# Altium schematic sheet MotorBoardHighRes.SchDoc
size A
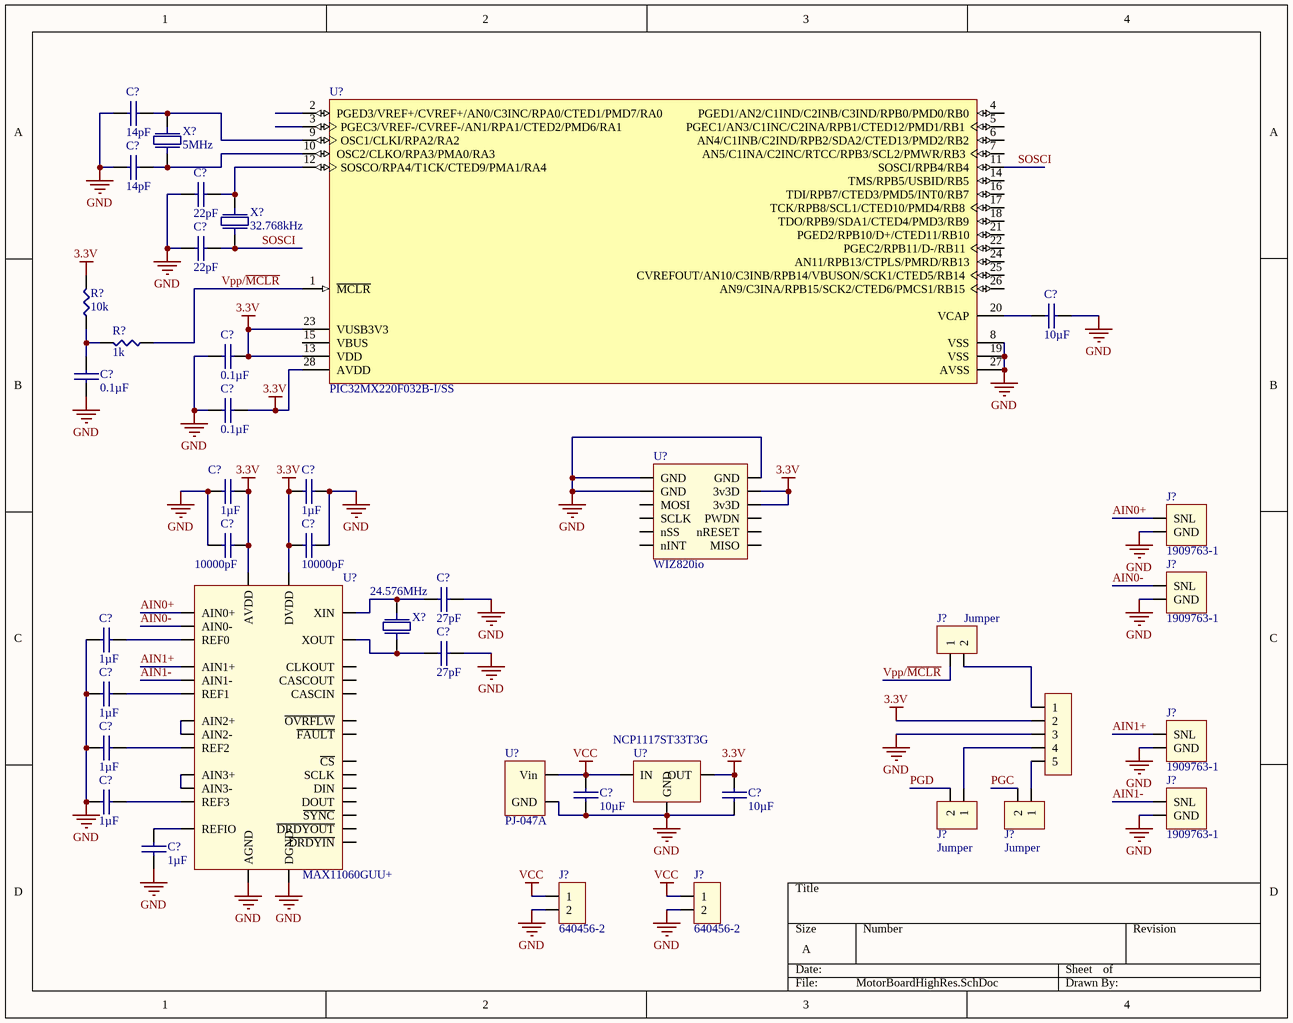
[diagram p0: MotorBoardHighRes.SchDoc]

## Parts
(Parts that share a designator on the sheet are numbered #1, #2 ... from top to bottom, then left to right.)
C?#1  14pF  [C0805]
C?#2  14pF  [C0805]
C?#3  22pF  [C1210]
C?#4  22pF  [C1210]
C?#5  10µF  [C1812]
C?#6  0.1µF  [C1812]
C?#7  0.1µF  [C1812]
C?#8  0.1µF  [C1812]
C?#9  1µF  [C1812]
C?#10  1µF  [C1812]
C?#11  10000pF  [C1812]
C?#12  10000pF  [C1812]
C?#13  27pF  [C1812]
C?#14  1µF  [C1812]
C?#15  27pF  [C1812]
C?#16  1µF  [C1812]
C?#17  1µF  [C1812]
C?#18  10µF  [C1812]
C?#19  10µF  [C1812]
C?#20  1µF  [C1812]
C?#21  1µF  [C1812]
J?#1  1909763-1  [A118077CT-ND]
J?#2  1909763-1  [A118077CT-ND]
J?#3  Jumper  [A1921-ND]
J?#4  1909763-1  [A118077CT-ND]
J?#5  Jumper  [A1921-ND]
J?#6  Jumper  [A1921-ND]
J?#7  1909763-1  [A118077CT-ND]
J?#8  640456-2  [A1921-ND]
J?#9  640456-2  [A1921-ND]
R?#1  10k  [R2010]
R?#2  1k  [R2010]
U?#1  PIC32MX220F032B-I/SS  [MCHP-SSOP-SS28_N]
U?#2  WIZ820io  [WIZ5200]
U?#3  MAX11060GUU+  [MAX11060GUU+-ND]
U?#4  ProgrammingHeader  [ProgrammingHeader]  (value not drawn)
U?#5  PJ-047A  [PJ-047A]
U?#6  NCP1117ST33T3G  [NCP1117ST33T3GOSCT-ND]
X?#1  5MHz  [NX8045GB-5MHZ-STD-CSF-3]
X?#2  32.768kHz  [MC-306 32.7680K-A0:ROHS]
X?#3  24.576MHz  [370-1160-1-ND/535-10195-1-ND]

## Nets
3.3V: C?#6.2 C?#8.2 C?#9.1 C?#10.1 C?#11.2 C?#12.1 C?#19.1 R?#1.2 U?#1.13(VDD) U?#1.23(VUSB3V3) U?#1.28(AVDD) U?#2.10(3v3D) U?#2.11(3v3D) U?#3.12,27(DVDD) U?#3.30(AVDD) U?#4.2 U?#6.2(OUT)
GND: C?#1.1 C?#2.1 C?#3.1 C?#4.1 C?#5.2 C?#6.1 C?#7.2 C?#8.1 C?#9.2 C?#10.2 C?#11.1 C?#12.2 C?#13.2 C?#14.1 C?#15.2 C?#16.1 C?#17.1 C?#18.2 C?#19.2 C?#20.1 C?#21.1 J?#1.1(GND) J?#2.1(GND) J?#4.1(GND) J?#7.1(GND) J?#8.2 J?#9.2 U?#1.8(VSS) U?#1.19(VSS) U?#1.27(AVSS) U?#2.1(GND) U?#2.2(GND) U?#2.12(GND) U?#3.4,8,10,29,31,35(AGND) U?#3.11,28(DGND) U?#4.3 U?#5.2(GND) U?#6.1(GND)
VCC: C?#18.1 J?#8.1 J?#9.1 U?#5.1(Vin) U?#6.3(IN)
AIN0+: J?#1.2(SNL) U?#3.1(AIN0+)
AIN0-: J?#2.2(SNL) U?#3.2(AIN0-)
AIN1+: J?#4.2(SNL) U?#3.5(AIN1+)
AIN1-: J?#7.2(SNL) U?#3.6(AIN1-)
PGC: J?#6.2
PGD: J?#5.2
SOSCI: C?#4.2 U?#1.11(SOSCI/RPB4/RB4) X?#2.2
Vpp/~{MCLR}: J?#3.1 R?#2.1 U?#1.1(~{MCLR})
NetC?#1_2: C?#1.2 U?#1.9(OSC1/CLKI/RPA2/RA2) X?#1.2
NetC?#2_2: C?#2.2 U?#1.10(OSC2/CLKO/RPA3/PMA0/RA3) X?#1.1
NetC?#3_2: C?#3.2 U?#1.12(SOSCO/RPA4/T1CK/CTED9/PMA1/RA4) X?#2.1
NetC?#5_1: C?#5.1 U?#1.20(VCAP)
NetC?#7_1: C?#7.1 R?#1.1 R?#2.2
NetC?#13_1: C?#13.1 U?#3.26(XIN) X?#3.1
NetC?#14_2: C?#14.2 U?#3.3(REF0)
NetC?#15_1: C?#15.1 U?#3.25(XOUT) X?#3.2
NetC?#16_2: C?#16.2 U?#3.7(REF1)
NetC?#17_2: C?#17.2 U?#3.36(REF2)
NetC?#20_2: C?#20.2 U?#3.32(REF3)
NetC?#21_2: C?#21.2 U?#3.9(REFIO)
NetJ?#3_2: J?#3.2 U?#4.1
NetJ?#5_1: J?#5.1 U?#4.4
NetJ?#6_1: J?#6.1 U?#4.5
NetU?#3_33: U?#3.33(AIN3+) U?#3.34(AIN3-)
NetU?#3_37: U?#3.37(AIN2+) U?#3.38(AIN2-)

Not connected (* = marked no-connect by the designer): U?#1 2(PGED3/VREF+/CVREF+/AN0/C3INC/RPA0/CTED1/PMD7/RA0) 3(PGEC3/VREF-/CVREF-/AN1/RPA1/CTED2/PMD6/RA1) 4(PGED1/AN2/C1IND/C2INB/C3IND/RPB0/PMD0/RB0) 5(PGEC1/AN3/C1INC/C2INA/RPB1/CTED12/PMD1/RB1) 6(AN4/C1INB/C2IND/RPB2/SDA2/CTED13/PMD2/RB2) 7(AN5/C1INA/C2INC/RTCC/RPB3/SCL2/PMWR/RB3) 14(TMS/RPB5/USBID/RB5) 15(VBUS) 16(TDI/RPB7/CTED3/PMD5/INT0/RB7) 17(TCK/RPB8/SCL1/CTED10/PMD4/RB8) 18(TDO/RPB9/SDA1/CTED4/PMD3/RB9) 21(PGED2/RPB10/D+/CTED11/RB10) 22(PGEC2/RPB11/D-/RB11) 24(AN11/RPB13/CTPLS/PMRD/RB13) 25(CVREFOUT/AN10/C3INB/RPB14/VBUSON/SCK1/CTED5/RB14) 26(AN9/C3INA/RPB15/SCK2/CTED6/PMCS1/RB15); U?#2 3(MOSI) 4(SCLK) 5(nSS) 6(nINT) 7(MISO) 8(nRESET) 9(PWDN); U?#3 13(CASCIN) 14(CASCOUT) 15(~{CS}) 17(DIN) 18(DOUT) 19(~{FAULT}) 20(~{OVRFLW}) 21(SCLK) 22(~{DRDYOUT}) 23(~{DRDYIN}) 24(~{SYNC})

## Library data of the parts
C?#1 C?#2 = CL21C140JBANNNC: CAP CER 14PF 50V 5% NP0 0805; Manufacturer: Samsung Electro-Mechanics America, Inc; Temperature Coefficient: C0G, NP0; Supplier 1: Digi-Key; Manufacturer Part Number: CL21C140JBANNNC; RoHS: RoHS Compliant; Category: Capacitors; Stock 1: 11837; Pricing 1: 1=0.1, 10=0.022, 25=0.0156, 100=0.0102, 500=0.00712, 1000=0.00555 (USD); Packaging: Cut Tape (CT); Capacitance: 14pF; Tolerance: ±5%; Voltage - Rated: 50V; Mounting Type: Surface Mount, MLCC; Operating Temperature: -55°C ~ 125°C; Applications: General Purpose; Ratings: -; Package / Case: 0805 (2012 Metric); Size / Dimension: 0.079" L x 0.049" W (2.00mm x 1.25mm); Height - Seated (Max): -; Thickness (Max): 0.030" (0.75mm); Lead Spacing: -; Features: -; Lead Style: -; ComponentLink1URL: http://www.samsungsem.com/kr/front/downloadcms.do?path=/kr/support/product-search/mlcc/__icsFiles/afieldfile/2014/11/05&fileName=S_CL21C140JBANNNC.pdf; ComponentLink1Description: http://www.samsungsem.com/kr/front/downloadcms.do?path=/kr/support/product-search/mlcc/__icsFiles/afieldfile/2014/11/05&fileName=S_CL21C140JBANNNC.pdf; Supplier Part Number 1: 1276-2584-1-ND
C?#3 C?#4 = C1210C220J5GACTU: CAP CER 22PF 50V 5% NP0 1210; Manufacturer: Kemet; Temperature Coefficient: C0G, NP0; Supplier 1: Digi-Key; Manufacturer Part Number: C1210C220J5GACTU; RoHS: RoHS Compliant; Category: Capacitors; Stock 1: 6772; Pricing 1: 1=0.74, 10=0.704, 50=0.42, 100=0.3413, 250=0.28352, 500=0.25726, 1000=0.23625 (USD); Packaging: Cut Tape (CT); Capacitance: 22pF; Tolerance: ±5%; Voltage - Rated: 50V; Mounting Type: Surface Mount, MLCC; Operating Temperature: -55°C ~ 125°C; Applications: General Purpose; Ratings: -; Package / Case: 1210 (3225 Metric); Size / Dimension: 0.126" L x 0.098" W (3.20mm x 2.50mm); Height - Seated (Max): -; Thickness (Max): 0.035" (0.88mm); Lead Spacing: -; Features: -; Lead Style: -; ComponentLink1URL: http://www.kemet.com/docfinder?Partnumber=C1210C220J5GACTU; ComponentLink1Description: http://www.kemet.com/docfinder?Partnumber=C1210C220J5GACTU; Supplier Part Number 1: 399-9402-1-ND
C?#5 C?#18 C?#19 = C4532X7R1C106K230KM: CAP CER 10UF 16V 10% X7R 1812; Manufacturer: TDK Corporation; Supplier 1: Digi-Key; Manufacturer Part Number: C4532X7R1C106K230KM; RoHS: RoHS Compliant; Category: Capacitors; Stock 1: 1685; Pricing 1: 1=1.01, 10=0.846, 100=0.54, 250=0.45 (USD); Packaging: Cut Tape (CT); Capacitance: 10µF; Tolerance: ±10%; Voltage - Rated: 16V; Temperature Coefficient: X7R; Mounting Type: Surface Mount, MLCC; Operating Temperature: -55°C ~ 125°C; Applications: General Purpose; Ratings: -; Package / Case: 1812 (4532 Metric); Size / Dimension: 0.177" L x 0.126" W (4.50mm x 3.20mm); Height - Seated (Max): -; Thickness (Max): 0.098" (2.50mm); Lead Spacing: -; Features: -; Lead Style: -; ComponentLink1URL: http://product.tdk.com/capacitor/mlcc/en/documents/mlcc_commercial_openmode_en.pdf; ComponentLink1Description: http://product.tdk.com/capacitor/mlcc/en/documents/mlcc_commercial_openmode_en.pdf; Supplier Part Number 1: 445-6105-1-ND
C?#6-C?#8 = C1812C104J1GACTU: CAP CER 0.1UF 100V 5% NP0 1812; Manufacturer: Kemet; Temperature Coefficient: C0G, NP0; Supplier 1: Digi-Key; Manufacturer Part Number: C1812C104J1GACTU; RoHS: RoHS Compliant; Category: Capacitors; Stock 1: 22617; Pricing 1: 1=0.95, 10=0.75, 50=0.65, 100=0.5625, 250=0.5, 500=0.425 (USD); Packaging: Cut Tape (CT); Capacitance: 0.1µF; Tolerance: ±5%; Voltage - Rated: 100V; Mounting Type: Surface Mount, MLCC; Operating Temperature: -55°C ~ 125°C; Applications: General Purpose; Ratings: -; Package / Case: 1812 (4532 Metric); Size / Dimension: 0.177" L x 0.126" W (4.50mm x 3.20mm); Height - Seated (Max): -; Thickness (Max): 0.055" (1.40mm); Lead Spacing: -; Features: -; Lead Style: -; ComponentLink1URL: http://www.kemet.com/docfinder?Partnumber=C1812C104J1GACTU; ComponentLink1Description: http://www.kemet.com/docfinder?Partnumber=C1812C104J1GACTU; Supplier Part Number 1: 399-5371-1-ND
C?#9 C?#10 C?#14 C?#16 C?#17 C?#20 C?#21 = C4532X7R1H105K160KM: CAP CER 1UF 50V 10% X7R 1812; Manufacturer: TDK Corporation; Supplier 1: Digi-Key; Manufacturer Part Number: C4532X7R1H105K160KM; RoHS: RoHS Compliant; Category: Capacitors; Stock 1: 1417; Pricing 1: 1=0.83, 10=0.703, 100=0.4111, 250=0.34476, 500=0.31162 (USD); Packaging: Cut Tape (CT); Capacitance: 1µF; Tolerance: ±10%; Voltage - Rated: 50V; Temperature Coefficient: X7R; Mounting Type: Surface Mount, MLCC; Operating Temperature: -55°C ~ 125°C; Applications: General Purpose; Ratings: -; Package / Case: 1812 (4532 Metric); Size / Dimension: 0.177" L x 0.126" W (4.50mm x 3.20mm); Height - Seated (Max): -; Thickness (Max): 0.071" (1.80mm); Lead Spacing: -; Features: -; Lead Style: -; ComponentLink1URL: http://product.tdk.com/capacitor/mlcc/en/documents/mlcc_commercial_openmode_en.pdf; ComponentLink1Description: http://product.tdk.com/capacitor/mlcc/en/documents/mlcc_commercial_openmode_en.pdf; Supplier Part Number 1: 445-6108-1-ND
C?#11 C?#12 = C1812C103K5RACTU: CAP CER 10000PF 50V 10% X7R 1812; Manufacturer: Kemet; Supplier 1: Digi-Key; Manufacturer Part Number: C1812C103K5RACTU; RoHS: RoHS Compliant; Category: Capacitors; Stock 1: 1900; Pricing 1: 1=0.67, 10=0.642, 25=0.4556, 50=0.3836, 100=0.3116, 250=0.25888 (USD); Packaging: Cut Tape (CT); Capacitance: 10000pF; Tolerance: ±10%; Voltage - Rated: 50V; Temperature Coefficient: X7R; Mounting Type: Surface Mount, MLCC; Operating Temperature: -55°C ~ 125°C; Applications: General Purpose; Ratings: -; Package / Case: 1812 (4532 Metric); Size / Dimension: 0.177" L x 0.126" W (4.50mm x 3.20mm); Height - Seated (Max): -; Thickness (Max): 0.043" (1.10mm); Lead Spacing: -; Features: -; Lead Style: -; ComponentLink1URL: http://www.kemet.com/docfinder?Partnumber=C1812C103K5RACTU; ComponentLink1Description: http://www.kemet.com/docfinder?Partnumber=C1812C103K5RACTU; Supplier Part Number 1: 399-9423-1-ND
C?#13 C?#15 = C1812C270JCGACTU: CAP CER 27PF 500V 5% NP0 1812; Manufacturer: Kemet; Temperature Coefficient: C0G, NP0; Supplier 1: Digi-Key; Manufacturer Part Number: C1812C270JCGACTU; RoHS: RoHS Compliant; Category: Capacitors; Stock 1: 3538; Pricing 1: 1=1.75, 10=1.433, 50=1.2586, 100=1.0138, 250=0.83904, 500=0.75164 (USD); Packaging: Cut Tape (CT); Capacitance: 27pF; Tolerance: ±5%; Voltage - Rated: 500V; Mounting Type: Surface Mount, MLCC; Operating Temperature: -55°C ~ 125°C; Applications: SMPS Filtering; Ratings: -; Package / Case: 1812 (4532 Metric); Size / Dimension: 0.177" L x 0.126" W (4.50mm x 3.20mm); Height - Seated (Max): -; Thickness (Max): 0.071" (1.80mm); Lead Spacing: -; Features: High Voltage; Lead Style: -; ComponentLink1URL: http://www.kemet.com/docfinder?Partnumber=C1812C270JCGACTU; ComponentLink1Description: http://www.kemet.com/docfinder?Partnumber=C1812C270JCGACTU; Supplier Part Number 1: 399-7281-1-ND
J?#1 J?#2 J?#4 J?#7 = 1909763-1: CONN UMCC JACK STR 50OHM SMD; Manufacturer: TE Connectivity; Connector Type: Jack, Male Pin; Contact Termination: Solder; Frequency - Max: 6GHz; Body Material: Copper Alloy; Body Finish: Gold; Dielectric Material: Liquid Crystal Polymer (LCP); Supplier 1: Digi-Key; Manufacturer Part Number: 1909763-1; RoHS: RoHS Compliant; Category: Connectors, Interconnects; Stock 1: 36500; Pricing 1: 1=0.58, 10=0.548, 25=0.4932, 50=0.4386, 100=0.4203, 250=0.38372, 500=0.36544, 1000=0.30149, 5000=0.24086 (USD); Packaging: Cut Tape (CT); Connector Style: UMCC; Shield Termination: Solder; Impedance: 50 Ohm; Mounting Type: Surface Mount; Cable Group: -; Fastening Type: Push-Pull; Features: -; Housing Color: Ivory; Ingress Protection: -; Center Contact Material: Copper Alloy; Center Contact Plating: Gold; Voltage Rating: -; Operating Temperature: -40°C ~ 90°C; ComponentLink1URL: http://www.te.com/commerce/DocumentDelivery/DDEController?Action=srchrtrv&DocNm=1909763&DocType=Customer+Drawing&DocLang=English; ComponentLink1Description: http://www.te.com/commerce/DocumentDelivery/DDEController?Action=srchrtrv&DocNm=1909763&DocType=Customer+Drawing&DocLang=English; Supplier Part Number 1: A118077CT-ND
J?#8 J?#9 = 640456-2: CONN HEADER VERT 2POS .100 TIN; Manufacturer: TE Connectivity; Connector Type: Header, Unshrouded; Number of Positions: 2; Number of Positions Loaded: All; Pitch: 0.100" (2.54mm); Supplier 1: Digi-Key; Manufacturer Part Number: 640456-2; RoHS: RoHS Compliant; Category: Connectors, Interconnects; Stock 1: 39569; Pricing 1: 1=0.14, 10=0.13, 50=0.0832, 100=0.0804, 250=0.06936, 500=0.06658, 1000=0.05825, 2500=0.05271, 5000=0.04993 (USD); Packaging: Bulk; Contact Type: Male Pin; Number of Rows: 1; Row Spacing: -; Contact Mating Length: 0.295" (7.49mm); Mounting Type: Through Hole; Termination: Solder; Fastening Type: Friction Lock; Features: -; Contact Finish: Tin; Contact Finish Thickness: -; Color: Natural; ComponentLink1URL: http://www.te.com/commerce/DocumentDelivery/DDEController?Action=srchrtrv&DocNm=640456&DocType=Customer+Drawing&DocLang=English; ComponentLink1Description: http://www.te.com/commerce/DocumentDelivery/DDEController?Action=srchrtrv&DocNm=640456&DocType=Customer+Drawing&DocLang=English; Supplier Part Number 1: A1921-ND
R?#1 = CRCW201010K0FKEF: RES SMD 10K OHM 1% 3/4W 2010; Manufacturer: Vishay Dale; Power (Watts): 0.75W, 3/4W; Temperature Coefficient: ±100ppm/°C; Supplier 1: Digi-Key; Manufacturer Part Number: CRCW201010K0FKEF; RoHS: RoHS Compliant; Category: Resistors; Stock 1: 12252; Pricing 1: 10=0.33, 50=0.1776, 200=0.102, 1000=0.0696 (USD); Packaging: Cut Tape (CT); Tolerance: ±1%; Composition: Thick Film; Features: Automotive AEC-Q200; Operating Temperature: -55°C ~ 155°C; Package / Case: 2010 (5025 Metric); Supplier Device Package: 2010 (5025 Metric); Size / Dimension: 0.197" L x 0.098" W (5.00mm x 2.50mm); Height: 0.028" (0.70mm); Number of Terminations: 2; ComponentLink1URL: http://www.vishay.com/docs/20035/dcrcwe3.pdf; ComponentLink1Description: http://www.vishay.com/docs/20035/dcrcwe3.pdf; Supplier Part Number 1: 541-10.0KACCT-ND; Resistance (Ohms): 10k
R?#2 = CRCW20101K00FKEF: RES SMD 1K OHM 1% 3/4W 2010; Manufacturer: Vishay Dale; Power (Watts): 0.75W, 3/4W; Temperature Coefficient: ±100ppm/°C; Supplier 1: Digi-Key; Manufacturer Part Number: CRCW20101K00FKEF; RoHS: RoHS Compliant; Category: Resistors; Stock 1: 50823; Pricing 1: 10=0.33, 50=0.1776, 200=0.102, 1000=0.0696 (USD); Packaging: Cut Tape (CT); Tolerance: ±1%; Composition: Thick Film; Features: Automotive AEC-Q200; Operating Temperature: -55°C ~ 155°C; Package / Case: 2010 (5025 Metric); Supplier Device Package: 2010 (5025 Metric); Size / Dimension: 0.197" L x 0.098" W (5.00mm x 2.50mm); Height: 0.028" (0.70mm); Number of Terminations: 2; ComponentLink1URL: http://www.vishay.com/docs/20035/dcrcwe3.pdf; ComponentLink1Description: http://www.vishay.com/docs/20035/dcrcwe3.pdf; Supplier Part Number 1: 541-1.00KACCT-ND; Resistance (Ohms): 1k
U?#1 = PIC32MX220F032B-I/SS: 32-bit Microcontroller with Audio and Graphics Interface, USB and Advanced Analog, 50 MHz, 19 I/O, PMP, -40 to 85 degC, 28-pin SSOP (SS28), Tube; Manufacturer: Microchip; DatasheetVersion: Rev. E; PackageVersion: C04-073B; PackageReference: SSOP-SS28; PackageDescription: 28-Lead Plastic Shrink Small Outline, 10.2 x 5.3 mm Body, 0.65 mm Pitch; Supplier 1: Digi-Key; Supplier Part Number 1: PIC32MX220F032B-I/SS-ND; Supplier 2: Farnell; Supplier Part Number 2: 2057070; Supplier 3: Newark; Supplier Part Number 3: 39T6794; Supplier 4: Mouser; Supplier Part Number 4: 579-32MX220F032BISS; Mounting Technology: Surface Mount; PartNumber: PIC32MX220F032B-I/SS; ComponentLink1Description: Manufacturer URL; ComponentLink1URL: http://www.microchip.com; ComponentLink2Description: Datasheet; ComponentLink2URL: http://ww1.microchip.com/downloads/en/DeviceDoc/61168E.pdf; ComponentLink3Description: Package Specification; ComponentLink3URL: http://www.microchip.com/stellent/groups/techpub_sg/documents/packagingspec/en012702.pdf; ComponentLink4Description: Product URL; ComponentLink4URL: http://www.microchip.com/PIC32MX220F032B
U?#2 = WIZ820io: Ethernet Modules W5200 & MAG JACK ioPLATFORM MODULE; Manufacturer: WIZnet; Description/Function: Plug-in network module; Interface Type: SPI; Number of Ports: 1 Ethernet; Operating Supply Voltage: 3.3 V; Supplier 1: Mouser; Manufacturer Part Number: WIZ820io; RoHS: RoHS Compliant; Category: Ethernet Modules; Stock 1: 175; Pricing 1: 1=28.07, 50=26.85, 100=26.11, 250=25.41 (AUD); Dimensions: 23 mm x 25 mm; Processor Type: W5200; Product: Serial to Ethernet Modules; Brand: WIZnet; Maximum Operating Temperature: + 85 C; Minimum Operating Temperature: - 40 C; RoHS - Mouser: Y; Minimum Order Quantity: 1; Reeling: False; ComponentLink1URL: http://www.mouser.com/ds/2/443/WIZ820io_User_Manual_V1.0-268459.pdf; ComponentLink1Description: http://www.mouser.com/ds/2/443/WIZ820io_User_Manual_V1.0-268459.pdf; Supplier Part Number 1: 950-WIZ820IO
U?#3 = MAX11060GUU+: IC ADC 16BIT DELTA SIGMA 38TSSOP; Manufacturer: Maxim Integrated; Number of Bits: 16; Sampling Rate (Per Second): 64k; Number of Inputs: 4; Input Type: Differential; Data Interface: SPI; Ratio - S/H:ADC: 0:1; Architecture: Sigma-Delta; Reference Type: External, Internal; Voltage - Supply, Analog: 3 V ~ 3.6 V; Voltage - Supply, Digital: 2.7 V ~ 3.6 V; Supplier 1: Digi-Key; Manufacturer Part Number: MAX11060GUU+; RoHS: RoHS Compliant; Category: Integrated Circuits (ICs); Stock 1: 139; Pricing 1: 1=6.48, 10=6.156, 50=6.12 (USD); Packaging: Tube; Configuration: ADC; Number of A/D Converters: 4; Features: -; Operating Temperature: -40°C ~ 105°C; Package / Case: 38-TFSOP (0.173", 4.40mm Width); Supplier Device Package: 38-TSSOP; ComponentLink1URL: http://datasheets.maximintegrated.com/en/ds/MAX11040K-MAX11060.pdf; ComponentLink1Description: http://datasheets.maximintegrated.com/en/ds/MAX11040K-MAX11060.pdf; Supplier Part Number 1: MAX11060GUU+-ND
U?#5 = PJ-047A: CON PWR JCK 2.0 X 6.0MM W/SHLD; Manufacturer: CUI Inc; Connector Type: Jack; Gender: Male; Plug/Mating Plug Diameter: 2.1mm ID, 5.5mm OD; Number of Positions/Contacts: 2 Conductors, 3 Contacts; Internal Switch(s): Single Switch, Normally Closed; Shielding: Shielded; Voltage - Rated: 16VDC; Current Rating: 2.5A; Supplier 1: Digi-Key; Manufacturer Part Number: PJ-047A; RoHS: RoHS Compliant; Category: Connectors, Interconnects; Stock 1: 7767; Pricing 1: 1=0.97, 10=0.752, 100=0.5738, 500=0.459, 1000=0.408, 2500=0.33915 (USD); Mounting Type: Through Hole, Right Angle; Termination: Solder; Features: Board Guide; Color: Black; Contact Material: Brass; Contact Material - Plating: Nickel; Housing Color: Black; Housing Material: Thermoplastic; Operating Temperature: -25°C ~ 85°C; ComponentLink1URL: http://www.cui.com/product/resource/digikeypdf/pj-047a.pdf; ComponentLink1Description: http://www.cui.com/product/resource/digikeypdf/pj-047a.pdf; Supplier Part Number 1: CP-047A-ND
U?#6 = NCP1117ST33T3G: IC REG LDO 3.3V 1A SOT223; Manufacturer: ON Semiconductor; Regulator Topology: Positive Fixed; Voltage - Dropout (Typical): 1.07V @ 800mA; Number of Regulators: 1; Voltage - Input: Up to 20V; Supplier 1: Digi-Key; Manufacturer Part Number: NCP1117ST33T3G; RoHS: RoHS Compliant; Category: Integrated Circuits (ICs); Stock 1: 14166; Pricing 1: 1=0.49, 10=0.417, 25=0.3652, 100=0.3127, 250=0.2712, 500=0.22972, 1000=0.1771 (USD); Packaging: Cut Tape (CT); Voltage - Output: 3.3V; Current - Output: 1A; Current - Limit (Min): 1A; Operating Temperature: 0°C ~ 125°C; Mounting Type: Surface Mount; Package / Case: TO-261-4, TO-261AA; Supplier Device Package: SOT-223; ComponentLink1URL: http://www.onsemi.com/pub_link/Collateral/NCP1117-D.PDF; ComponentLink1Description: http://www.onsemi.com/pub_link/Collateral/NCP1117-D.PDF; Supplier Part Number 1: NCP1117ST33T3GOSCT-ND; Supplier Short Name: NCP1117
X?#1 = NX8045GB-5MHZ-STD-CSF-3: CRYSTAL 5MHZ 8PF SMD; Manufacturer: NDK; Frequency Stability: ±30ppm; Frequency Tolerance: ±20ppm; ESR (Equivalent Series Resistance): 250 Ohm; Operating Mode: Fundamental; Supplier 1: Digi-Key; Manufacturer Part Number: NX8045GB-5MHZ-STD-CSF-3; RoHS: RoHS Compliant; Category: Crystals and Oscillators; Stock 1: 2394; Pricing 1: 1=0.64, 10=0.531, 50=0.4766, 100=0.4241, 500=0.40392 (USD); Packaging: Cut Tape (CT); Type: MHz Crystal; Frequency: 5MHz; Load Capacitance: 8pF; Operating Temperature: -10°C ~ 70°C; Ratings: -; Mounting Type: Surface Mount; Package / Case: 2-SMD, No Lead (DFN, LCC); Size / Dimension: 0.315" L x 0.177" W (8.00mm x 4.50mm); Height: 0.079" (2.00mm); ComponentLink1URL: http://www.ndk.com/images/products/catalog/c_NX8045GB-STD-CSF-4_e.pdf; ComponentLink1Description: http://www.ndk.com/images/products/catalog/c_NX8045GB-STD-CSF-4_e.pdf; Supplier Part Number 1: 644-1202-1-ND
X?#2 = MC-306 32.7680K-A0:ROHS: CRYSTAL 32.768KHZ 12.5PF SMD; Manufacturer: EPSON; Frequency Tolerance: ±20ppm; ESR (Equivalent Series Resistance): 35 kOhm; Operating Mode: Fundamental; Supplier 1: Digi-Key; Manufacturer Part Number: MC-306 32.7680K-A0:ROHS; RoHS: RoHS Compliant; Category: Crystals and Oscillators; Stock 1: 47198; Pricing 1: 1=0.85, 10=0.75, 50=0.7006, 100=0.62 (USD); Packaging: Cut Tape (CT); Type: kHz Crystal (Tuning Fork); Frequency: 32.768kHz; Frequency Stability: -; Load Capacitance: 12.5pF; Operating Temperature: -40°C ~ 85°C; Ratings: -; Mounting Type: Surface Mount; Package / Case: 4-SOJ, 5.50mm pitch; Size / Dimension: 0.315" L x 0.126" W (8.00mm x 3.20mm); Height: 0.100" (2.54mm); ComponentLink1URL: http://media.digikey.com/pdf/Data%20Sheets/Epson%20PDFs/MC-306%20,405,%20406.pdf; ComponentLink1Description: http://media.digikey.com/pdf/Data%20Sheets/Epson%20PDFs/MC-306%20,405,%20406.pdf; Supplier Part Number 1: SER2407CT-ND
X?#3 = ABLS-LR-24.576MHZ-F-T: CRYSTAL 24.576MHZ 18PF SMD; Manufacturer: Abracon LLC; Frequency Stability: ±50ppm; ESR (Equivalent Series Resistance): 10 Ohm; Operating Mode: Fundamental; Supplier 1: Digi-Key; Manufacturer Part Number: ABLS-LR-24.576MHZ-F-T; RoHS: RoHS Compliant; Category: Crystals and Oscillators; Stock 1: 674; Pricing 1: 1=1.53, 10=1.469, 50=1.4366, 100=1.2285, 500=1.196 (USD); Packaging: Cut Tape (CT); Type: MHz Crystal; Frequency: 24.576MHz; Frequency Tolerance: ±50ppm; Load Capacitance: 18pF; Operating Temperature: 0°C ~ 70°C; Ratings: -; Mounting Type: Surface Mount; Package / Case: HC49/US; Size / Dimension: 0.449" L x 0.185" W (11.40mm x 4.70mm); Height: 0.165" (4.20mm); ComponentLink1URL: http://www.abracon.com/Resonators/ABLS-LR.pdf; ComponentLink1Description: http://www.abracon.com/Resonators/ABLS-LR.pdf; Supplier Part Number 1: 535-10195-1-ND